# EAGLE design screw-front-single-a-1 (EAGLE 9.6.2)
AUTHOR: Balazs Racz; DRAWING_TITLE: MEB Schalterwerk Projekt; LICENSE: Licensed by the Solderpad Hardware License V2.0; REVIEWER: n/a; REVISION: A5; YEAR: 2023
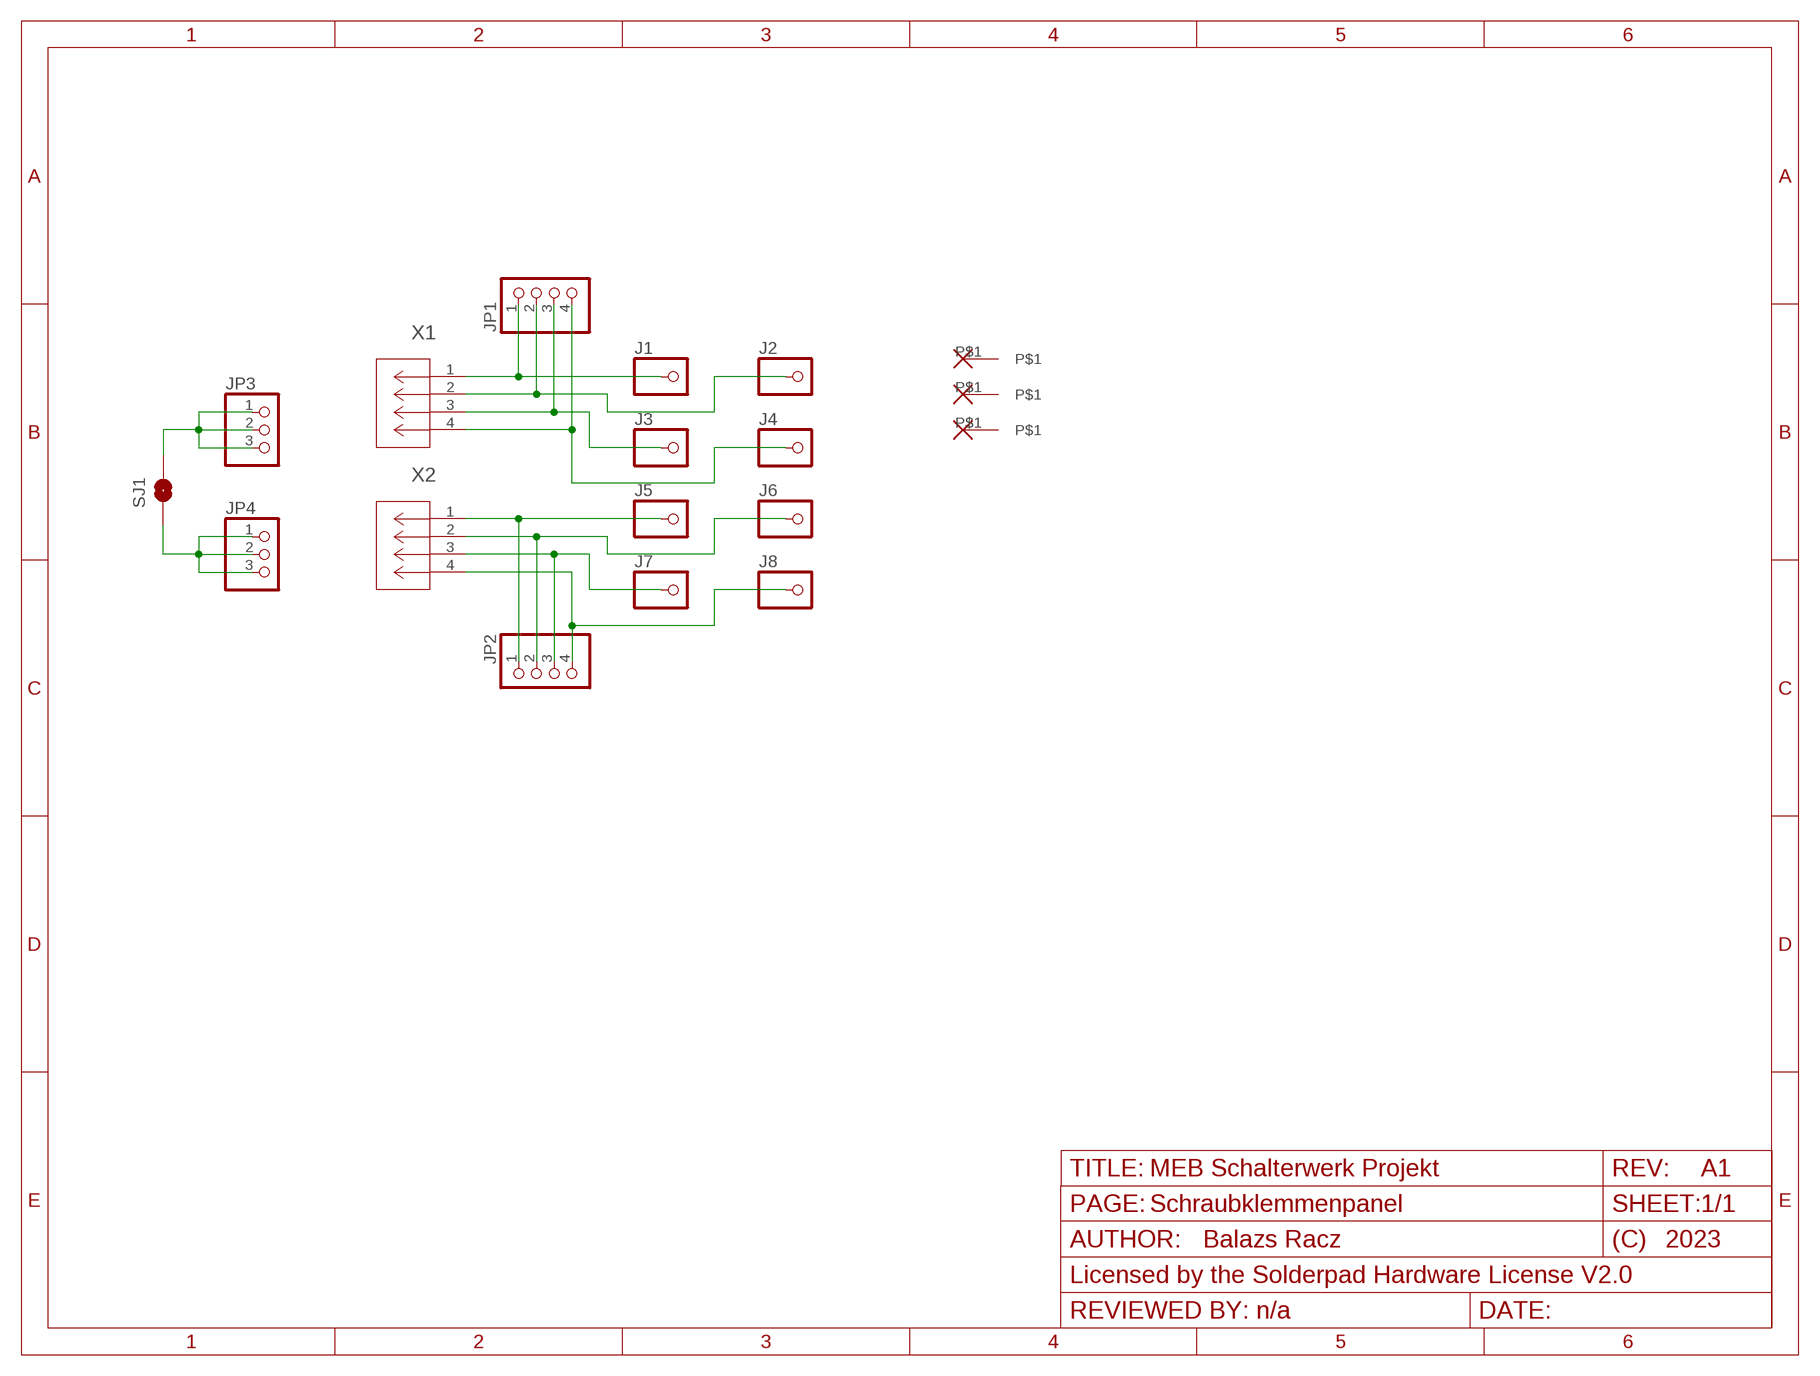
[diagram p0: schematic, sheet 1]
FRAME1 (FRAME_A_L): PAGE: Input ports
FRAME2 (FRAME_A_L): PAGE: Schraubklemmenpanel; REVISION: A1

## Parts
H5  ALIGN-HOLE  [ALIGNMENT-HOLE]
H6  ALIGN-HOLE  [ALIGNMENT-HOLE]
H7  ALIGN-HOLE  [ALIGNMENT-HOLE]
J1  M4-SCREW-HOLE  [M4-SCREW-HOLE]
J2  M4-SCREW-HOLE  [M4-SCREW-HOLE]
J3  M4-SCREW-HOLE  [M4-SCREW-HOLE]
J4  M4-SCREW-HOLE  [M4-SCREW-HOLE]
J5  M4-SCREW-HOLE  [M4-SCREW-HOLE]
J6  M4-SCREW-HOLE  [M4-SCREW-HOLE]
J7  M4-SCREW-HOLE  [M4-SCREW-HOLE]
J8  M4-SCREW-HOLE  [M4-SCREW-HOLE]
JP1  PINHD-1X4  [1X04]
JP2  PINHD-1X4  [1X04]
JP3  PINHD-1X3  [1X03]
JP4  PINHD-1X3  [1X03]
SJ1  SJRND2  [SJ_RND2]
X1  PHNX_4P_350CONN_1984989_PXC  [PHNX_4P_350]
X2  PHNX_4P_350CONN_1984989_PXC  [PHNX_4P_350]

## Nets
N$1: J1.P$1 JP1.1 X1.1
N$2: J2.P$1 JP1.2 X1.2
N$3: J3.P$1 JP1.3 X1.3
N$4: J4.P$1 JP1.4 X1.4
N$5: J5.P$1 JP2.1 X2.1
N$6: J6.P$1 JP2.2 X2.2
N$7: J7.P$1 JP2.3 X2.3
N$8: J8.P$1 JP2.4 X2.4
N$9: JP3.1 JP3.2 JP3.3 SJ1.P$2
N$10: JP4.1 JP4.2 JP4.3 SJ1.P$1
Unconnected: H5.P$1 H6.P$1 H7.P$1

## Library data of the parts
H5-H7 = eagleparts:ALIGN-HOLE
J1-J8 = eagleparts:M4-SCREW-HOLE
JP1 JP2 = pinhead:PINHD-1X4: PIN HEADER
JP3 JP4 = pinhead:PINHD-1X3: PIN HEADER
SJ1 = eagleparts:SJ: SMD solder JUMPER
X1 X2 = eagleparts:PHNX_4P_350: https://www.digikey.com/en/products/detail/phoenix-contact/1984989/2513979 DigiKey 277-6404-ND; COPYRIGHT: Copyright (C) 2023 Ultra Librarian. All rights reserved.; MANUFACTURER_PART_NUMBER: 1984989; MFR_NAME: Phoenix Contact

## Board
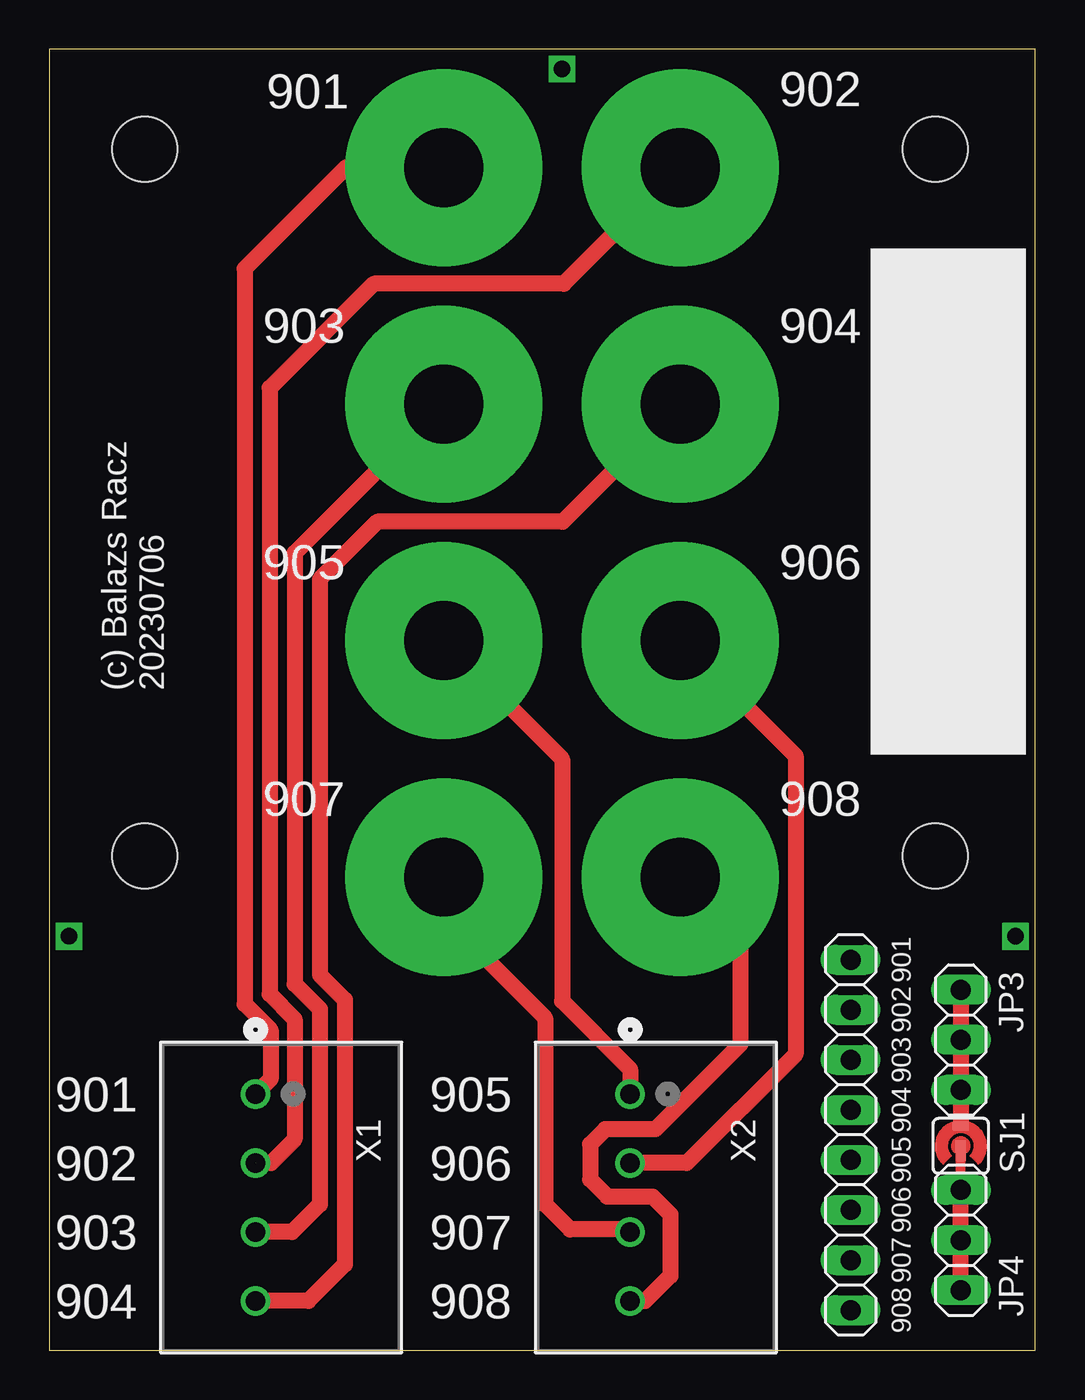
[diagram p1: board, top side]
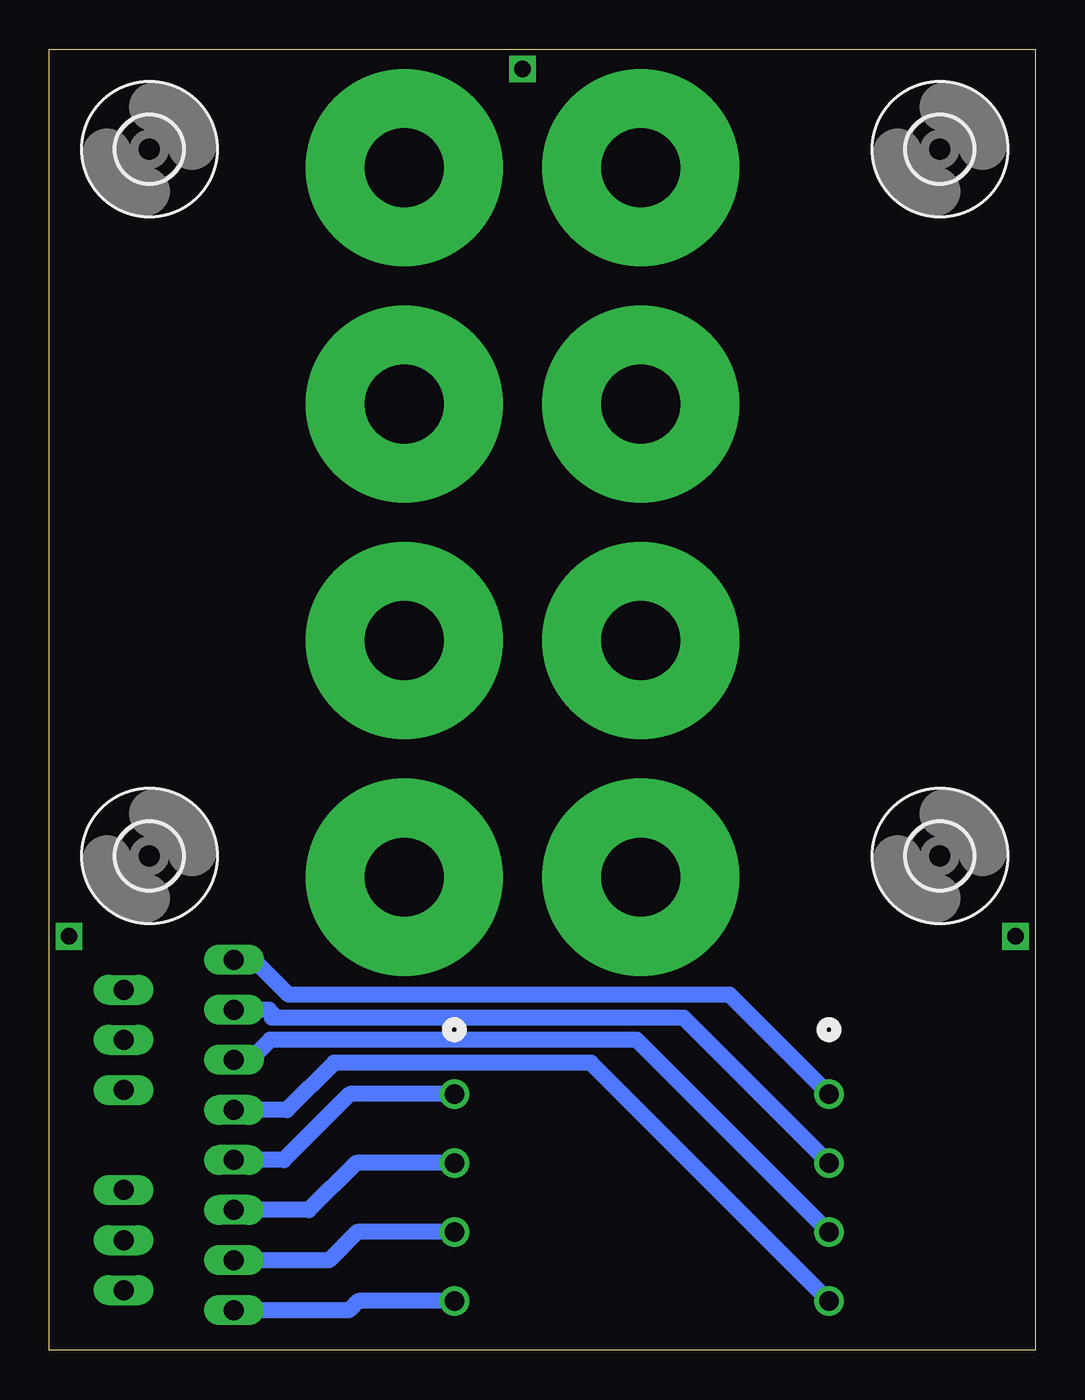
[diagram p2: board, bottom side, seen from below]

Size 50 x 66 mm. Coordinates in mm from the lower left corner, seen from the top.
Outline: 0,0 50,0 50,66 0,66 0,0
Copper layers (1*16): Top 0.035mm / dielectric 1.5mm / Bottom 0.035mm
Design rules "SeeedStudio_2layer_DRU_no_angle_20140221": minimum track width 6mil, minimum drill 12mil, track to track 6mil, track to pad 6mil, pad to pad 6mil, via to via 6mil, smd to smd 0mil, copper to edge 10mil, drill to drill 10mil, minimum pad ring 10mil, minimum via ring 6mil, stop-mask expansion 2mil, vias tented up to drill 100mil, thermal gap 10mil

### Footprints (pad centres in the part's own frame; a part is rotated, then mirrored left to right if it is on the bottom)
3,3 = hole 3.3: 0,0
ALIGNMENT-HOLE = drill 0.85 square: P$1 0,0
M4-SCREW-HOLE = drill 4 pad 10: P$1 0,0
1X04 = drill 1.016 long: 1 -3.81,0; 2 -1.27,0; 3 1.27,0; 4 3.81,0
1X03 = drill 1.016 long: 1 -2.54,0; 2 0,0; 3 2.54,0
SJ_RND2 = smd 1.016 x 0.508: P$1 -0.254,0 | smd 0.406 x 0.813: P$2 1.016,0
PHNX_4P_350 = drill 0.991 pad 1.499: 1 0,0; 2 3.5,0; 3 7,0; 4 10.5,0

### Placement (x,y rotation side)
H1  MOUNT-HOLE3.3  [3,3]  4.83,60.93 0 bottom
H2  MOUNT-HOLE3.3  [3,3]  4.83,25.08 0 bottom
H3  MOUNT-HOLE3.3  [3,3]  44.92,25.08 0 bottom
H4  MOUNT-HOLE3.3  [3,3]  44.92,60.93 0 bottom
H5  26,65 0 top
H6  1,21 0 top
H7  49,21 0 top
J1  20,60 0 top
J2  32,60 0 top
J3  20,48 0 top
J4  32,48 0 top
J5  20,36 0 top
J6  32,36 0 top
J7  20,24 0 top
J8  32,24 0 top
JP1  40.64,16 270 top
JP2  40.64,5.84 270 top
JP3  46.23,15.75 90 top
JP4  46.23,5.59 90 top
SJ1  46.23,10.36 90 top
X1  10.46,13 270 top
X2  29.46,13 270 top

### Tracks (layer width: path | path; a pad name or v marks a point on that pad's centre or on a via)
N$1
  Top 0.813: J1.P$1 15.04,60 9.91,54.86 9.91,17.56 11.22,16.24 11.22,13.76 X1.1
  Bottom 0.813: X1.1 15.49,18.03 37.85,18.03 39.62,19.81 | 39.88,19.81 JP1.1
N$2  (1 unrouted)
  Top 0.813: J2.P$1 26.1,54.1 16.46,54.1 11.18,48.81 11.18,18.07 12.45,16.8 12.45,10.7 11.25,9.5 X1.2
  Bottom 0.813: X1.2 17.83,16.87 38.71,16.87 | 38.46,16.87 38.86,17.27 JP1.2
N$3
  Top 0.813: J3.P$1 12.45,40.45 12.45,18.57 13.72,17.3 13.72,7.4 12.32,6 X1.3
  Bottom 0.813: X1.3 20.21,15.75 38.8,15.75 39.82,14.73 | 39.57,14.73 JP1.3
N$4
  Top 0.813: J4.P$1 26.04,42.04 16.64,42.04 13.72,39.12 13.72,19.05 14.99,17.78 14.99,4.35 13.14,2.5 X1.4
  Bottom 0.813: X1.4 22.54,14.58 35.56,14.58 37.95,12.19 JP1.4
N$5
  Top 0.813: J5.P$1 26.01,29.99 26.01,17.71 29.46,14.26 X2.1
  Bottom 0.813: X2.1 34.75,13 38.1,9.65 JP2.1
N$6
  Top 0.813: J6.P$1 37.85,30.15 37.85,15.02 32.33,9.5 X2.2
  Bottom 0.813: X2.2 34.44,9.5 36.83,7.11 JP2.2
N$7
  Top 0.813: J7.P$1 20,22 25.15,16.85 25.15,7.4 26.42,6.13 29.33,6.13 X2.3
  Bottom 0.813: X2.3 34.39,6 35.81,4.57 JP2.3
N$8
  Top 0.813: J8.P$1 35.05,20.95 35.05,15.53 30.73,11.21 28.19,11.21 27.43,10.45 27.43,8.67 28.3,7.8 30.58,7.8 31.5,6.89 31.5,3.77 30.22,2.5 X2.4
  Bottom 0.813: X2.4 34.33,2.5 34.8,2.03 JP2.4
N$9
  Top 0.508: SJ1.P$2 46.23,11.42
  Top 0.813: JP3.3 JP3.2 JP3.1 46.23,11.42 | 46.23,11.42
N$10
  Top 0.508: JP4.3 SJ1.P$1
  Top 0.813: JP4.1 JP4.2 JP4.3

### Text on the board
tNames: (c) Balazs Racz / 20230706